# Altium schematic sheet eps_obc_pay_sys.SchDoc
size A4
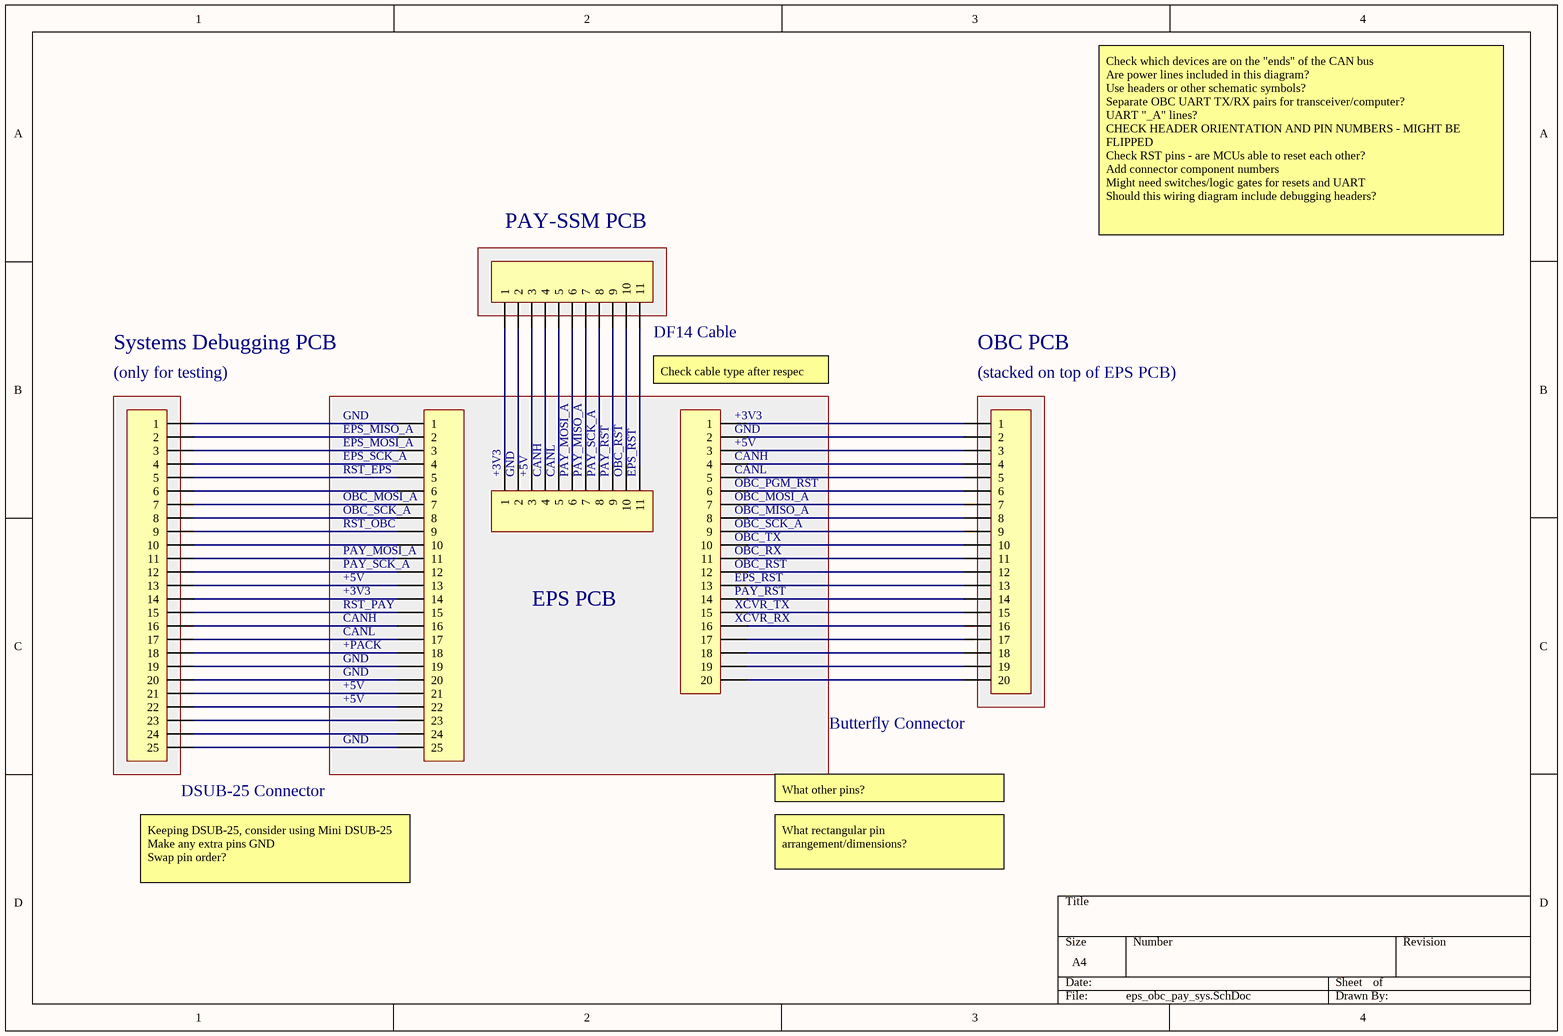
[diagram p0: eps_obc_pay_sys.SchDoc]

## Parts
(Parts that share a designator on the sheet are numbered #1, #2 ... from top to bottom, then left to right.)
P?#1  Header 11  [HDR1X11]  (value not drawn)
P?#2  Header 25  [HDR1X25]  (value not drawn)
P?#3  Header 25  [HDR1X25]  (value not drawn)
P?#4  Header 20  [HDR1X20]  (value not drawn)
P?#5  Header 20  [HDR1X20]  (value not drawn)
P?#6  Header 11  [HDR1X11]  (value not drawn)

## Blocks framed on the sheet
PAY-SSM PCB: P?#1
(only for testing): P?#2
EPS PCB: P?#3 P?#4 P?#6
(stacked on top of EPS PCB): P?#5

## Nets
NetP?#1_1: P?#1.1 P?#6.1
NetP?#1_2: P?#1.2 P?#6.2
NetP?#1_3: P?#1.3 P?#6.3
NetP?#1_4: P?#1.4 P?#6.4
NetP?#1_5: P?#1.5 P?#6.5
NetP?#1_6: P?#1.6 P?#6.6
NetP?#1_7: P?#1.7 P?#6.7
NetP?#1_8: P?#1.8 P?#6.8
NetP?#1_9: P?#1.9 P?#6.9
NetP?#1_10: P?#1.10 P?#6.10
NetP?#1_11: P?#1.11 P?#6.11
NetP?#2_1: P?#2.1 P?#3.1
NetP?#2_2: P?#2.2 P?#3.2
NetP?#2_3: P?#2.3 P?#3.3
NetP?#2_4: P?#2.4 P?#3.4
NetP?#2_5: P?#2.5 P?#3.5
NetP?#2_6: P?#2.6 P?#3.6
NetP?#2_7: P?#2.7 P?#3.7
NetP?#2_8: P?#2.8 P?#3.8
NetP?#2_9: P?#2.9 P?#3.9
NetP?#2_10: P?#2.10 P?#3.10
NetP?#2_11: P?#2.11 P?#3.11
NetP?#2_12: P?#2.12 P?#3.12
NetP?#2_13: P?#2.13 P?#3.13
NetP?#2_14: P?#2.14 P?#3.14
NetP?#2_15: P?#2.15 P?#3.15
NetP?#2_16: P?#2.16 P?#3.16
NetP?#2_17: P?#2.17 P?#3.17
NetP?#2_18: P?#2.18 P?#3.18
NetP?#2_19: P?#2.19 P?#3.19
NetP?#2_20: P?#2.20 P?#3.20
NetP?#2_21: P?#2.21 P?#3.21
NetP?#2_22: P?#2.22 P?#3.22
NetP?#2_23: P?#2.23 P?#3.23
NetP?#2_24: P?#2.24 P?#3.24
NetP?#2_25: P?#2.25 P?#3.25
NetP?#4_1: P?#4.1 P?#5.1
NetP?#4_2: P?#4.2 P?#5.2
NetP?#4_3: P?#4.3 P?#5.3
NetP?#4_4: P?#4.4 P?#5.4
NetP?#4_5: P?#4.5 P?#5.5
NetP?#4_6: P?#4.6 P?#5.6
NetP?#4_7: P?#4.7 P?#5.7
NetP?#4_8: P?#4.8 P?#5.8
NetP?#4_9: P?#4.9 P?#5.9
NetP?#4_10: P?#4.10 P?#5.10
NetP?#4_11: P?#4.11 P?#5.11
NetP?#4_12: P?#4.12 P?#5.12
NetP?#4_13: P?#4.13 P?#5.13
NetP?#4_14: P?#4.14 P?#5.14
NetP?#4_15: P?#4.15 P?#5.15
NetP?#4_16: P?#4.16 P?#5.16
NetP?#4_17: P?#4.17 P?#5.17
NetP?#4_18: P?#4.18 P?#5.18
NetP?#4_19: P?#4.19 P?#5.19
NetP?#4_20: P?#4.20 P?#5.20

## Notes on the sheet
- Check which devices are on the "ends" of the CAN bus
  Are power lines included in this diagram?
  Use headers or other schematic symbols?
  Separate OBC UART TX/RX pairs for transceiver/computer?
  UART "_A" lines?
  CHECK HEADER ORIENTATION AND PIN NUMBERS - MIGHT BE FLIPPED
  Check RST pins - are MCUs able to reset each other?
  Add connector component numbers
  Might need switches/logic gates for resets and UART
  Should this wiring diagram include debugging headers?
- Systems Debugging PCB
- (near P?#1) DF14 Cable
- (near P?#4) Check cable type after respec
- OBC PCB
- GND
- (near P?#3) EPS_MISO_A
- (near P?#3) EPS_MOSI_A
- (near P?#4) +3V3
- (near P?#4) GND
- (near P?#4) +5V
- (near P?#3) EPS_SCK_A
- (near P?#3) RST_EPS
- (near P?#3) OBC_MOSI_A
- (near P?#3) OBC_SCK_A
- (near P?#6) +3V3
- (near P?#6) GND
- (near P?#6) +5V
- (near P?#6) CANH
- (near P?#6) CANL
- (near P?#6) PAY_MOSI_A
- (near P?#6) PAY_MISO_A
- (near P?#6) PAY_SCK_A
- (near P?#6) PAY_RST
- (near P?#6) OBC_RST
- (near P?#6) EPS_RST
- (near P?#4) CANH
- (near P?#4) CANL
- (near P?#4) OBC_PGM_RST
- (near P?#4) OBC_MOSI_A
- (near P?#4) OBC_MISO_A
- (near P?#3) RST_OBC
- (near P?#3) PAY_MOSI_A
- (near P?#3) PAY_SCK_A
- +5V
- (near P?#4) OBC_RST
- (near P?#4) EPS_RST
- (near P?#4) OBC_TX
- (near P?#4) OBC_RX
- (near P?#4) OBC_SCK_A
- +3V3
- (near P?#3) RST_PAY
- CANH
- CANL
- (near P?#3) +PACK
- (near P?#4) PAY_RST
- (near P?#4) XCVR_TX
- (near P?#4) XCVR_RX
- (near P?#5) Butterfly Connector
- (near P?#2) DSUB-25 Connector
- What other pins?
- Keeping DSUB-25, consider using Mini DSUB-25
  Make any extra pins GND
  Swap pin order?
- What rectangular pin arrangement/dimensions?

## Library data of the parts
P?#1 P?#6 = Header 11: Header, 11-Pin; LatestRevisionDate: 17-Jul-2002; LatestRevisionNote: Re-released for DXP Platform.; Publisher: Altium Limited
P?#2 P?#3 = Header 25: Header, 25-Pin; LatestRevisionDate: 17-Jul-2002; LatestRevisionNote: Re-released for DXP Platform.; Publisher: Altium Limited
P?#4 P?#5 = Header 20: Header, 20-Pin; LatestRevisionDate: 17-Jul-2002; LatestRevisionNote: Re-released for DXP Platform.; Publisher: Altium Limited